# EAGLE schematic panner_ngspice (EAGLE 9.6.2)
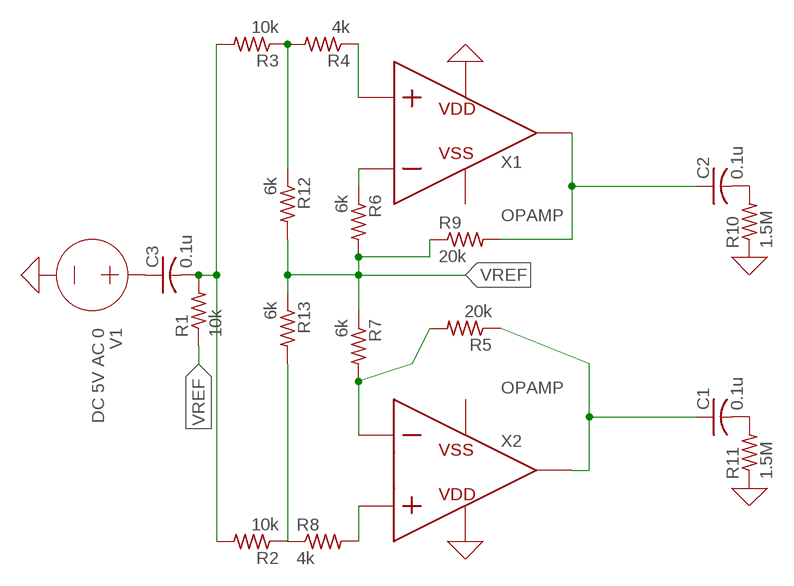
[diagram p0: schematic, sheet 1]

## Parts
C1  0.1u  C-US025-024X044  [C025-024X044]
C2  0.1u  C-US025-024X044  [C025-024X044]
C3  0.1u  C-US025-024X044  [C025-024X044]
R1  10k  R-US_0204/5  [0204/5]
R2  10k  R-US_0204/5  [0204/5]
R3  10k  R-US_0204/5  [0204/5]
R4  4k  R-US_0204/5  [0204/5]
R5  20k  R-US_0204/5  [0204/5]
R6  6k  R-US_0204/5  [0204/5]
R7  6k  R-US_0204/5  [0204/5]
R8  4k  R-US_0204/5  [0204/5]
R9  20k  R-US_0204/5  [0204/5]
R10  1.5M  R-US_0204/5  [0204/5]
R11  1.5M  R-US_0204/5  [0204/5]
R12  6k  R-US_0204/5  [0204/5]
R13  6k  R-US_0204/5  [0204/5]
V1  DC 5V AC 0  VOLTAGE  (no package)
X1  OPAMP  (no package)
X2  OPAMP  (no package)

## Nets
0: R10.1 R11.1 V1.- X1.VDD X2.VDD ; supply symbol labelled GND
N$1: C3.1 V1.+
N$2: C3.2 R1.2 R2.2 R3.2
N$4: R2.1 R8.1
N$6: R6.1 X1.N
N$7: R5.2 R7.2 X2.N
N$8: C1.1 R5.1 X2.VOUT
N$9: C2.1 R9.2 X1.VOUT
N$10: C1.2 R11.2
N$11: C2.2 R10.2
N$12: R8.2 X2.P
N$13: R4.1 X1.P
P0A: R3.1 R4.2 R12.1
P0B: R13.2
VREF: R1.1 R6.2 R7.1 R9.1 R12.2 R13.1
Unconnected: X1.VSS X2.VSS

## Library data of the parts
C1-C3 = rcl:C-US: CAPACITOR, American symbol; SPICEPREFIX: C
R1-R13 = rcl:R-US_: RESISTOR, American symbol; SPICEPREFIX: R
V1 = ngspice-simulation:VOLTAGE: Independent Voltage Source, either DC, AC, PULSE, SINE, PWL, EXP, or SFFM; SPICEPREFIX: V; VALUE: 0V
X1 X2 = ngspice-simulation:OPAMP: Operational amplifier with power pins